# Altium schematic sheet MAZ000187 - Diagrama físico.SchDoc: MAZ000187 - Diagrama físico
size A; ApprovedBy: Christian Ledwidth; CheckedBy: Nahuel Martinez; Author: Santiago Marti; CompanyName: Body Health; DrawnBy: Santiago Marti; Revision: A; SheetNumber: 2; SheetTotal: 2
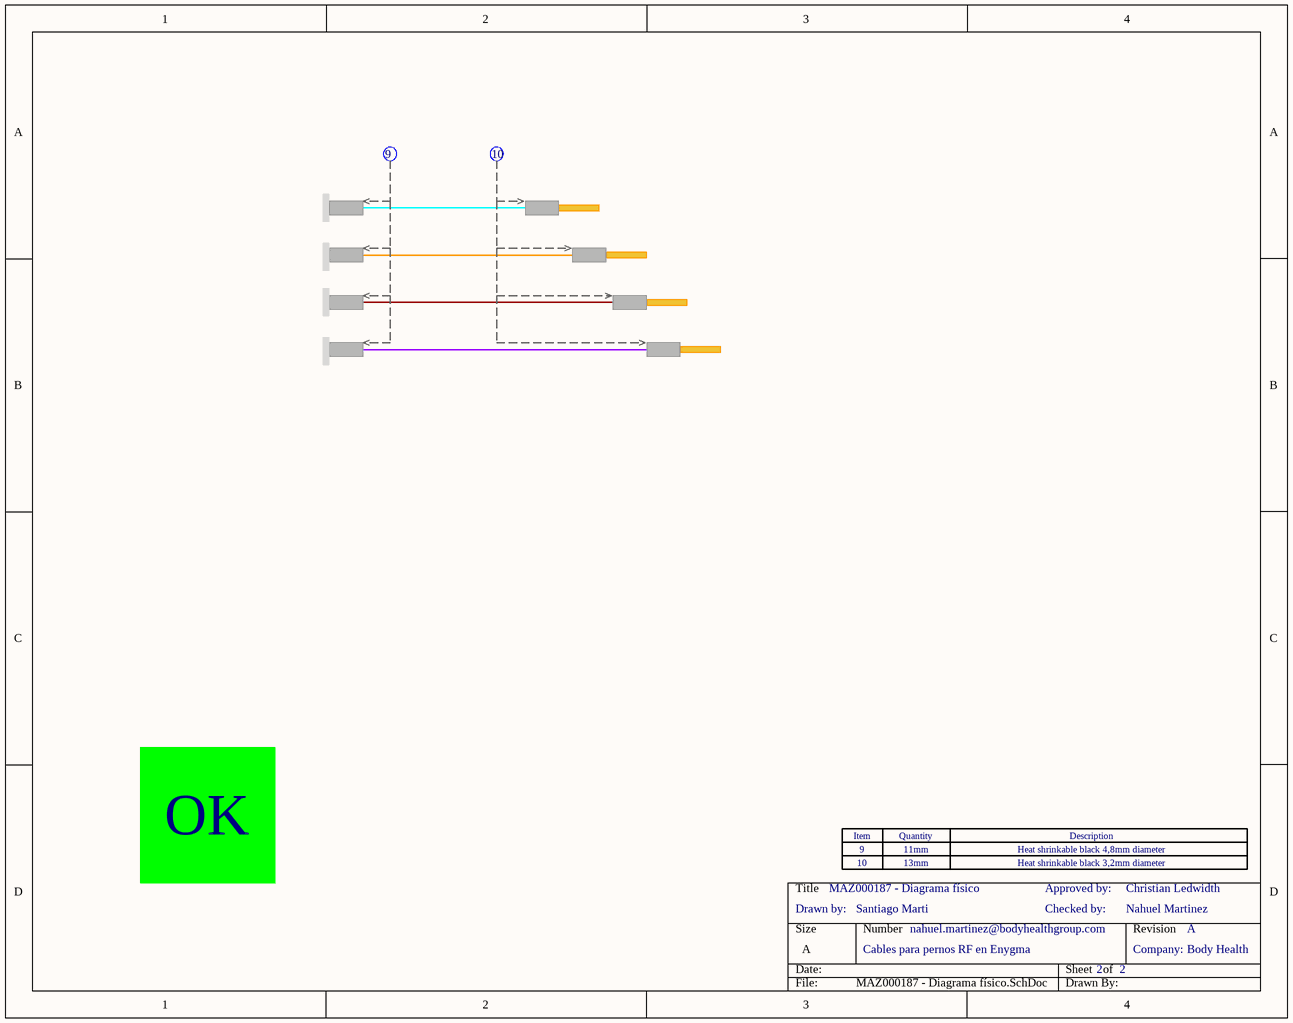
[diagram p0: MAZ000187 - Diagrama físico.SchDoc]

## Parts
(Parts that share a designator on the sheet are numbered #1, #2 ... from top to bottom, then left to right.)
Ter?#1  Termocontraible  (value not drawn)
Ter?#2  Termocontraible  (value not drawn)
Zoc?#1  Zócalo_Header  (value not drawn)
Zoc?#2  Zócalo_Item  (value not drawn)
Zoc?#3  Zócalo_Item  (value not drawn)

## Notes on the sheet
- OK
- (near Zoc?#3) Drawn by:
- (near Zoc?#1) 9
- (near Zoc?#2) 10
- 11mm
- 13mm
- Checked by:
- Approved by:
- Heat shrinkable black 4,8mm diameter
- Heat shrinkable black 3,2mm diameter
- Cables para pernos RF en Enygma
- nahuel.martinez@bodyhealthgroup.com
- Company:
- (in symbol Zócalo_Header) Item; Quantity; Description

## Library data of the parts
Ter?#1 = Termocontraible: CallOut: 9; Largo: *; Diámetro: *
Ter?#2 = Termocontraible: CallOut: 10; Largo: *; Diámetro: *
Zoc?#1 = Zócalo_Header: Header para el zócalo de referencias
Zoc?#2 Zoc?#3 = Zócalo_Item: Ítem para el zócalo de referencias; Desginator: *; Quantity: *; ItemDescription: *